# Altium schematic sheet SG_A2 Architecture.SchDoc
size A4; SheetNumber: 1; SheetTotal: 5
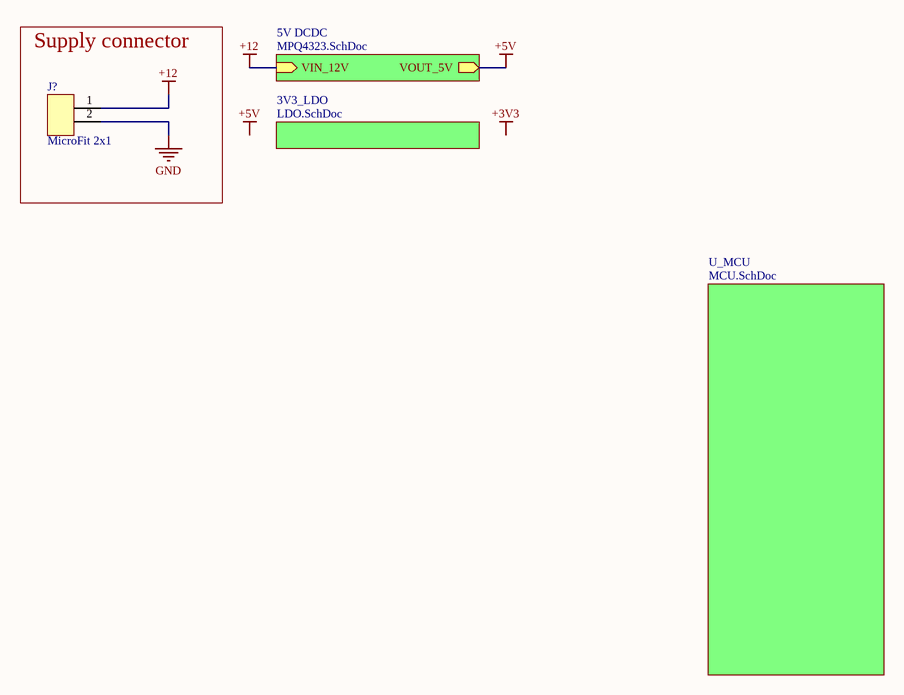
[diagram p0: SG_A2 Architecture.SchDoc]

## Parts
J?  MicroFit 2x1  [MOLEX_43045-0200]

## Blocks framed on the sheet
Supply connector: J?

## Sub-sheets
3V3_LDO = LDO.SchDoc: no entries
5V DCDC = MPQ4323.SchDoc: VIN_12V (in), VOUT_5V (out)
U_MCU = MCU.SchDoc: no entries

## Nets
+5V: sheet 5V DCDC/VOUT_5V
+12: J?.1 ; sheet 5V DCDC/VIN_12V
GND: J?.2

## Notes on the sheet
- Labels drawn without touching a wire or pin: +3V3, +5V